# Altium project Project.PrjPcb
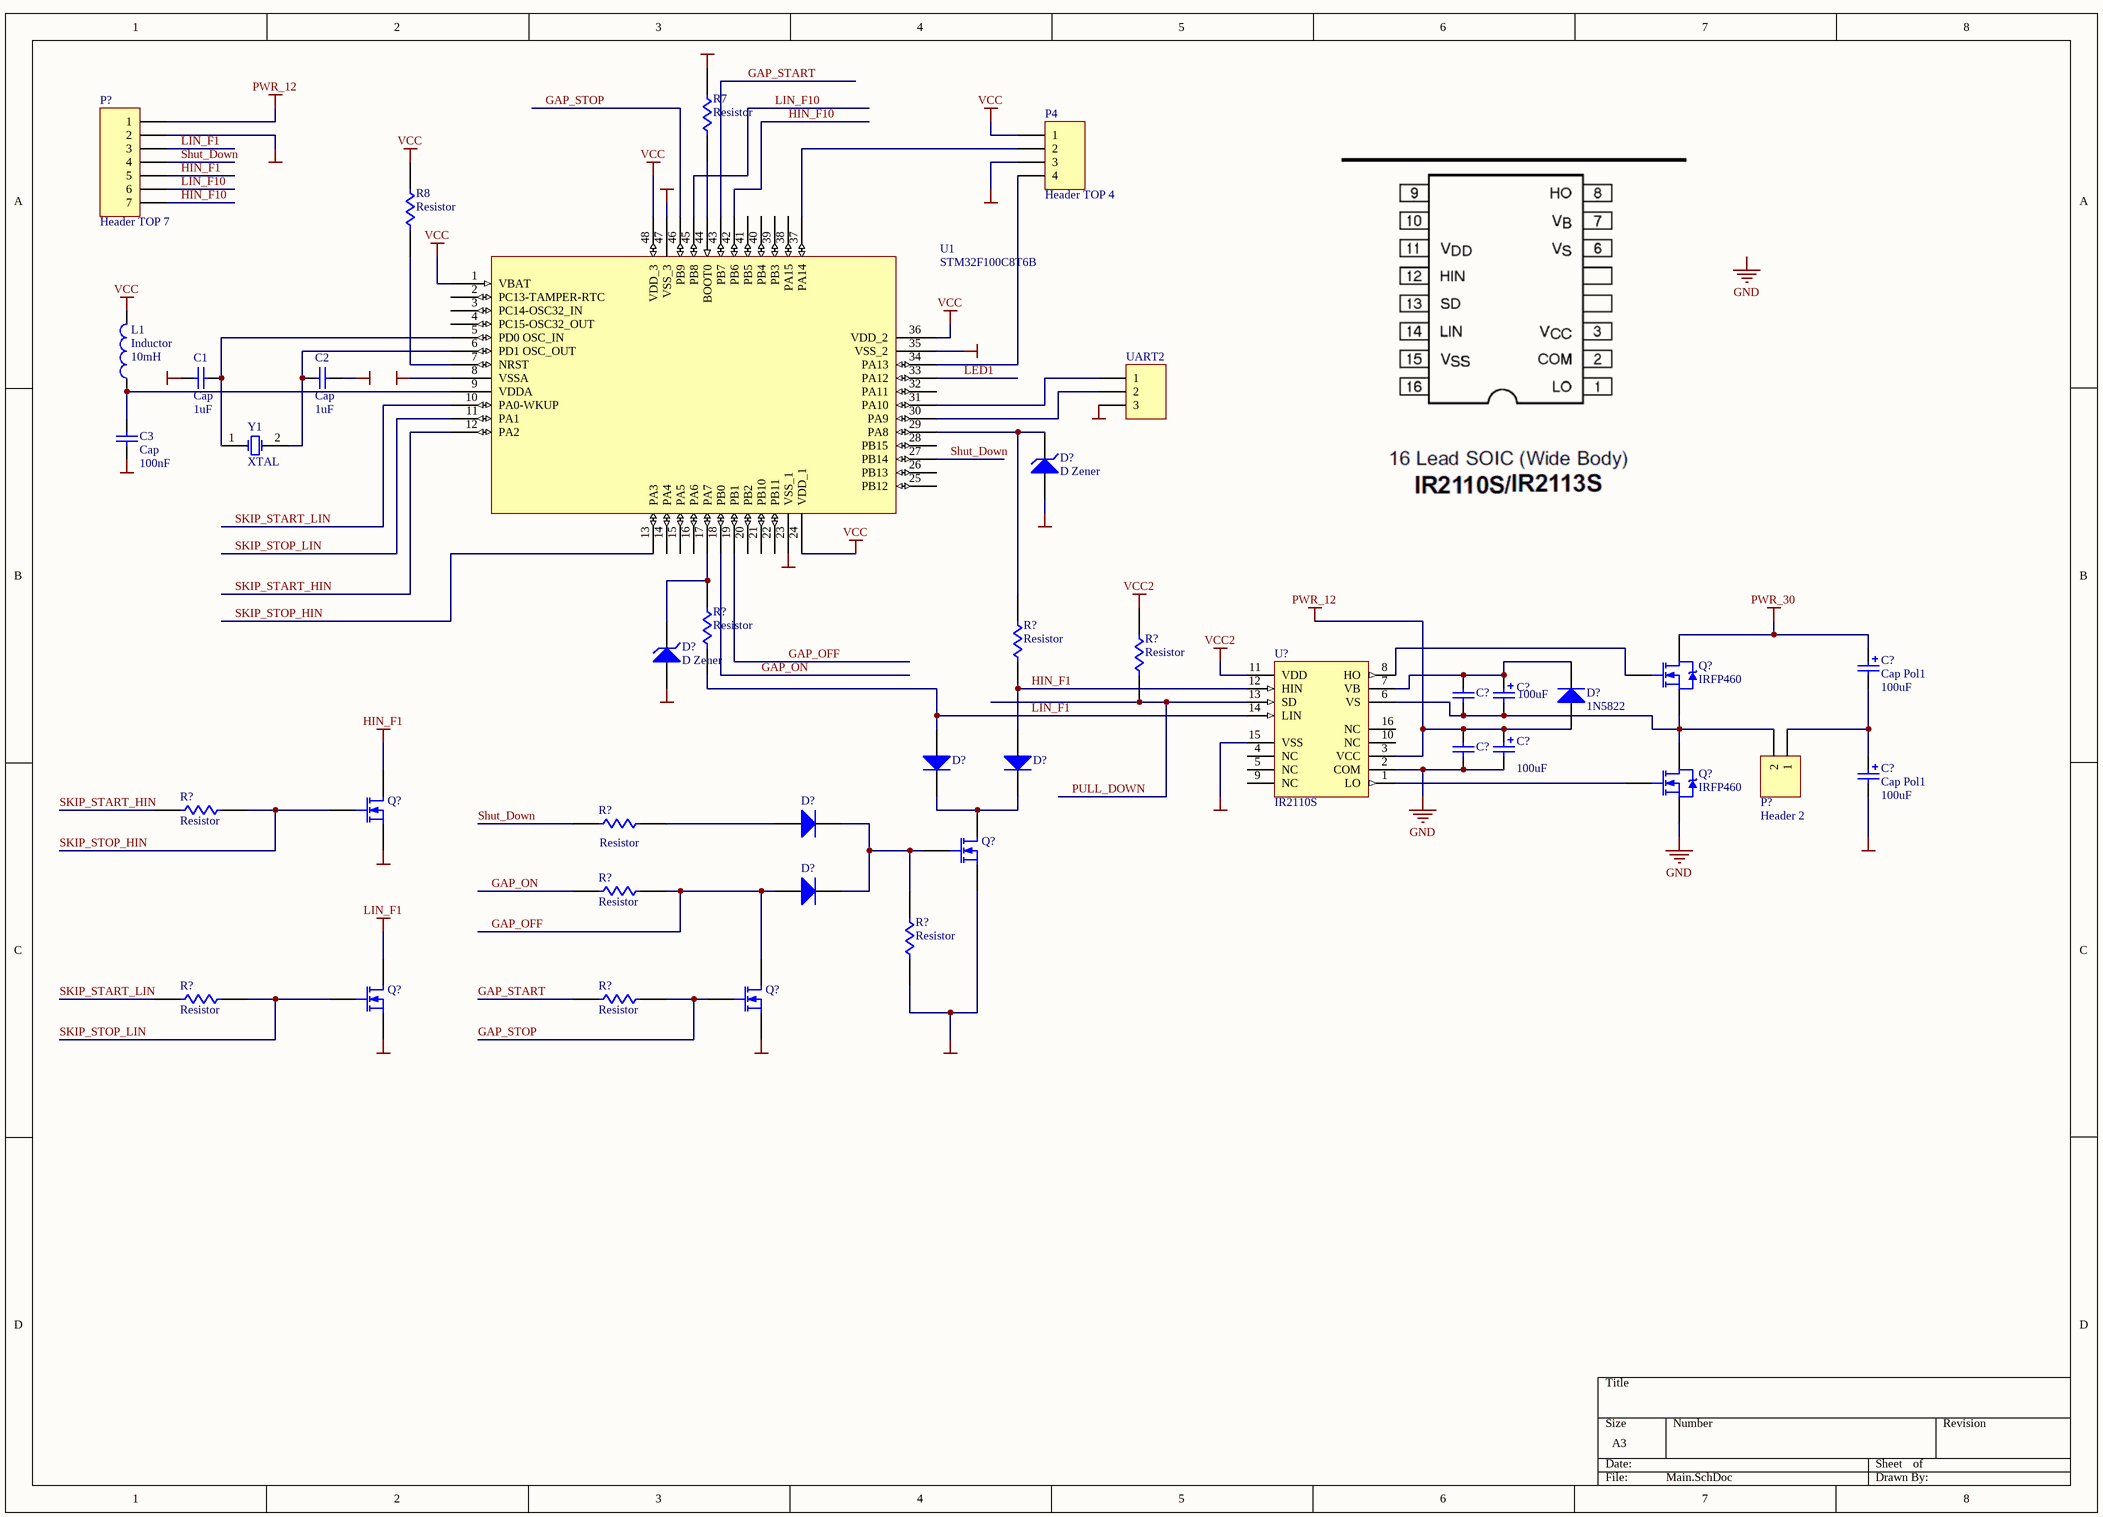
[diagram p0: Main.SchDoc]
2 sheets, 53 parts. Net scope: global (net labels, ports and power ports of the same name join across sheets).
Sheets:
  Main.SchDoc
  Uart.SchDoc

## Sheet Main.SchDoc
size A3; PageSetup: Record=PageOptions|CenterHorizontal=True|CenterVertical=True|PrintScale=1.47|XCorrection=1.00|YCorrection=1.00|PrintKind=1|BorderSize=5000000|LeftOffset=0|BottomOffset=0|Orientation=2|PaperLength=1000|PaperWidth=1000|Scale=100|PaperSource=7|PrintQuality=-4|MediaType=1|DitherType=10|PrintScaleMode=1|PaperKind=A2 420 x 594 мм

### Parts
(Parts that share a designator on the sheet are numbered #1, #2 ... from top to bottom, then left to right.)
C1  Cap  value 1uF  [6-0805_M]
C2  Cap  value 1uF  [6-0805_M]
C3  Cap  value 100nF  [6-0805_M]
C?#1  Cap Pol1  value 100uF  [RAD-0.3]
C?#2  value 100uF  [RAD-0.3]  (hidden comment: Cap Pol1)
C?#3  Cap  [RAD-0.3]  (value not drawn)
C?#4  value 100uF  [RAD-0.3]  (hidden comment: Cap Pol1)
C?#5  Cap  [RAD-0.3]  (value not drawn)
C?#6  Cap Pol1  value 100uF  [RAD-0.3]
D?#1  D Zener  [12Z-2010]
D?#2  D Zener  [12Z-2010]
D?#3  1N5822  [DO-41]
D?#4  Diode 1N4001  [DO-41]  (value not drawn)
D?#5  Diode 1N4001  [DO-41]  (value not drawn)
D?#6  Diode 1N4001  [DO-41]  (value not drawn)
D?#7  Diode 1N4001  [DO-41]  (value not drawn)
L1  Inductor  value 10mH  [INDC4532]
P4  Header TOP 4  [PIN_TOP_SMALL_4]
P?#1  Header TOP 7
P?#2  Header 2  [HDR1X2]
Q?#1  IRFP460  [TO-247AC]
Q?#2  IRFP460  [TO-247AC]
Q?#3  MOSFET-N  [E3]  (value not drawn)
Q?#4  MOSFET-N  [E3]  (value not drawn)
Q?#5  MOSFET-N  [E3]  (value not drawn)
Q?#6  MOSFET-N  [E3]  (value not drawn)
R7  Resistor  [6-0805_M]
R8  Resistor  [6-0805_M]
R?#1  Resistor  [6-0805_M]
R?#2  Resistor  [6-0805_M]
R?#3  Resistor  [6-0805_M]
R?#4  Resistor  [6-0805_M]
R?#5  Resistor  [6-0805_M]
R?#6  Resistor  [6-0805_M]
R?#7  Resistor  [6-0805_M]
R?#8  Resistor  [6-0805_M]
R?#9  Resistor  [6-0805_M]
U1  STM32F100C8T6B  [TQFP48_L]
U?#1  IR2110S  [SOIC16_M]
UART2  Header TOP 3  [PIN_TOP_SMALL_3]  (value not drawn)
Y1  XTAL  [RAD-0.3]

### Nets
GND: C1.2 C2.1 C3.1 C?#4.2 C?#5.1 C?#6.2 D?#1.2(A) D?#2.2(A) P4.3 P?#1.2 Q?#2.3(S) Q?#3.3(S) Q?#4.3(S) Q?#5.3(S) Q?#6.3(S) R7.1 R?#7.1 U1.8(VSSA) U1.23(VSS_1) U1.35(VSS_2) U1.47(VSS_3) U?#1.2(COM) U?#1.15(VSS) UART2.3
HIN_F1: D?#5.1(A) P?#1.5 Q?#3.1(D) R?#2.1 U?#1.12(HIN)
LIN_F1: D?#4.1(A) P?#1.3 Q?#5.1(D) R?#1.1 U?#1.14(LIN)
PWR_12: C?#4.1 C?#5.2 D?#3.1(A) P?#1.1 U?#1.3(VCC)
PWR_30: C?#1.1 Q?#1.2(D)
VCC: L1.2 P4.1 R8.1 U1.1(VBAT) U1.24(VDD_1) U1.36(VDD_2) U1.48(VDD_3)
VCC2: R?#3.1 U?#1.11(VDD)
GAP_OFF: D?#7.1(A) Q?#6.1(D) R?#6.1 U1.19(PB1)
GAP_ON: R?#6.2 U1.18(PB0)
GAP_START: R?#9.2 U1.43(PB7)
GAP_STOP: Q?#6.2(G) R?#9.1 U1.46(PB9)
HIN_F10: P?#1.7 U1.42(PB6)
LED1: U1.33(PA12)
LIN_F10: P?#1.6 U1.45(PB8)
PULL_DOWN: R?#3.2 U?#1.13(SD)
Shut_Down: P?#1.4 R?#5.1 U1.27(PB14)
SKIP_START_HIN: R?#4.2 U1.12(PA2)
SKIP_START_LIN: R?#8.2 U1.10(PA0-WKUP)
SKIP_STOP_HIN: Q?#3.2(G) R?#4.1 U1.13(PA3)
SKIP_STOP_LIN: Q?#5.2(G) R?#8.1 U1.11(PA1)
NetC1_1: C1.1 U1.5(PD0_OSC_IN) Y1.1(OSC1)
NetC2_2: C2.2 U1.6(PD1_OSC_OUT) Y1.2(OSC2)
NetC3_2: C3.2 L1.1 U1.9(VDDA)
NetC?#1_2: C?#1.2 C?#6.1 P?#2.1
NetC?#2_1: C?#2.1 C?#3.2 D?#3.2(K) U?#1.7(VB)
NetC?#2_2: C?#2.2 C?#3.1 P?#2.2 Q?#1.3(S) Q?#2.2(D) U?#1.6(VS)
NetD?#1_1: D?#1.1(K) R?#2.2 U1.29(PA8)
NetD?#2_1: D?#2.1(K) R?#1.2 U1.17(PA7)
NetD?#4_2: D?#4.2(K) D?#5.2(K) Q?#4.1(D)
NetD?#6_1: D?#6.1(A) R?#5.2
NetD?#6_2: D?#6.2(K) D?#7.2(K) Q?#4.2(G) R?#7.2
NetP4_2: P4.2 U1.37(PA14)
NetP4_4: P4.4 U1.34(PA13)
NetQ?#1_1: Q?#1.1(G) U?#1.8(HO)
NetQ?#2_1: Q?#2.1(G) U?#1.1(LO)
NetR7_2: R7.2 U1.44(BOOT0)
NetR8_2: R8.2 U1.7(NRST)
NetU1_30: U1.30(PA9) UART2.2
NetU1_31: U1.31(PA10) UART2.1

Not connected (* = marked no-connect by the designer): U1 2(PC13-TAMPER-RTC) 3(PC14-OSC32_IN) 4(PC15-OSC32_OUT) 14(PA4) 15(PA5) 16(PA6) 20(PB2) 21(PB10) 22(PB11) 25(PB12) 26(PB13) 28(PB15) 32(PA11) 38(PA15) 39(PB3) 40(PB4) 41(PB5); U?#1 4(NC) 5(NC) 9(NC) 10(NC) 16(NC)

### Notes on the sheet
- Labels drawn without touching a wire or pin: GND

### Library data of the parts
C1-C3 = Cap: Capacitor; Published: 8-Jun-2000; LatestRevisionDate: 17-Jul-2002; LatestRevisionNote: Re-released for DXP Platform.; PackageReference: RAD-0.3; Publisher: Altium Limited; PackageDescription: Radial Cap, Thru-Hole; 2 Leads; 0.3 in Pin Spacing
C?#1 C?#2 C?#4 C?#6 = Cap Pol1: Polarized Capacitor (Radial); Published: 8-Jun-2000; LatestRevisionDate: 17-Jul-2002; LatestRevisionNote: Re-released for DXP Platform.; PackageReference: RB7.6-15; Publisher: Altium Limited; PackageDescription: Polarized Capacitor (Radial); 2 Leads
C?#3 C?#5 = Cap: Capacitor; Value: 100pF; Published: 8-Jun-2000; LatestRevisionDate: 17-Jul-2002; LatestRevisionNote: Re-released for DXP Platform.; PackageReference: RAD-0.3; Publisher: Altium Limited; PackageDescription: Radial Cap, Thru-Hole; 2 Leads; 0.3 in Pin Spacing
D?#1 D?#2 = D Zener: Zener Diode; Published: 8-Jun-2000; LatestRevisionDate: 17-Jul-2002; LatestRevisionNote: Re-released for DXP Platform.; PackageReference: DIODE-0.7; Publisher: Altium Limited; PackageDescription: Diode, Thru-Hole; 2 Leads; 0.7 in Pin Spacing
D?#3-D?#7 = Diode 1N4001: 1 Amp General Purpose Rectifier; Published: 8-Jun-2000; LatestRevisionDate: 17-Jul-2002; LatestRevisionNote: Re-released for DXP Platform.; DatasheetVersion: 1998; PackageVersion: Aug-1999; PackageReference: DO-41; Publisher: Altium Limited; PackageDescription: Diode, Axial; Body 5.2 x 2.7 mm (LxDia. max), Lead Dia. 0.86 mm (max); Code_JEDEC: DO-204-AL; ComponentLink1Description: Manufacturer Link; ComponentLink1URL: http://www.fairchildsemi.com/; ComponentLink2Description: Datasheet; ComponentLink2URL: http://www.fairchildsemi.com/ds/1N%2F1N4001.pdf
L1 = Inductor: Code_IEC: 1005; Published: 8-Jun-2000; LatestRevisionDate: 29-May-2009; LatestRevisionNote: IPC-7351 Footprint Added.; PackageReference: 0402-A; Publisher: Altium Limited; PackageDescription: Chip Inductor; Code_JEITA: 0402
P4 = Header TOP 4: Header, 1Pin; LatestRevisionDate: 17-Jul-2002; LatestRevisionNote: Re-released for DXP Platform.; Publisher: Altium Limited
P?#1 = Header TOP 7: Header, 1Pin; LatestRevisionDate: 17-Jul-2002; LatestRevisionNote: Re-released for DXP Platform.; Publisher: Altium Limited
P?#2 = Header 2: Header, 2-Pin; LatestRevisionDate: 17-Jul-2002; LatestRevisionNote: Re-released for DXP Platform.; Publisher: Altium Limited
Q?#1 Q?#2 = IRFP460: HEXFET Power MOSFET; Note: Pin 2 is electrically connected to the Heatsink (4).; Published: 8-Jun-2000; LatestRevisionDate: 17-Jul-2002; LatestRevisionNote: Re-released for DXP Platform.; DatasheetVersion: PD-9.512B; PackageVersion: Aug-1997; PackageReference: TO-247AC; Publisher: Altium Limited; PackageDescription: SIP with Mounting Hole; 3 Leads; Body 20 x 15.6 x 5 mm (typ); Pitch 5.45 mm; Code_JEDEC: TO-247-AC; ComponentLink1Description: Manufacturer Link; ComponentLink1URL: http://www.irf.com/; ComponentLink2Description: Datasheet; ComponentLink2URL: http://www.irf.com/product-info/datasheets/data/irfp460.pdf
Q?#3-Q?#6 = MOSFET-N: N-Channel MOSFET; Published: 8-Jun-2000; LatestRevisionDate: 17-Jul-2002; LatestRevisionNote: Re-released for DXP Platform.; PackageVersion: 1995/1996; PackageReference: E3; Publisher: Altium Limited; PackageDescription: TO, Flat Index; 3 In-Line, Axial Leads; Body Dia. 4.6mm; Lead Dia. 0.5 mm (max)
U1 = STM32F100C8T6B: STM32 ARM-based 32-bit MCU with 32 Kbytes Flash, 48-pin LQFP, Industrial Temperature; Published: 30-May-2008; DatasheetVersion: rev6, Mar-2008; PackageVersion: Mar-2008; PackageReference: LQFP48; Publisher: Altium Limited; PackageDescription: 48-Pin Low-Profile Quad Flat Pack, 7 x 7 mm Body, 0.5 mm Pitch (LQFP48); ComponentLink1Description: Manufacturer Link; ComponentLink1URL: www.st.com/stm32; ComponentLink2Description: Datasheet; ComponentLink2URL: http://www.st.com/stonline/products/literature/ds/13586.pdf
U?#1 = IR2110S: High and Low Side Driver; Note: Pins 4, 5, 9, 10 and 16 are not connected; Published: 8-Jun-2000; LatestRevisionDate: 13-Apr-2006; LatestRevisionNote: IPC-7351 Footprint Added.; DatasheetVersion: PD60147J; PackageReference: SOIC16; Publisher: Altium Limited; PackageDescription: 16-Pin Small Outline Integrated Circuit 1.27 mm Pitch; Code_JEDEC: MS-013-AA; Code_IPC: SOIC127P1030-16; ComponentLink1Description: Manufacturer Link; ComponentLink1URL: http://www.irf.com/; ComponentLink2Description: Datasheet; ComponentLink2URL: http://www.irf.com/product-info/datasheets/data/ir2110.pdf
UART2 = Header TOP 3: Header, 1Pin; LatestRevisionDate: 17-Jul-2002; LatestRevisionNote: Re-released for DXP Platform.; Publisher: Altium Limited
Y1 = XTAL: Crystal Oscillator; Published: 8-Jun-2000; LatestRevisionDate: 17-Jul-2002; LatestRevisionNote: Re-released for DXP Platform.; PackageReference: R38; Publisher: Altium Limited; PackageDescription: Crystal, Thru-Hole; 2 Leads; Body 3.1 x 8.2 mm (Dia.xH)
R7 R8 R?#1-R?#9 = Resistor: Published: 24-Mar-1999; LatestRevisionDate: 29-May-2009; LatestRevisionNote: IPC-7351 Footprint Added.; PackageVersion: Mar-2003; PackageReference: 6-0805; Publisher: Altium Limited; PackageDescription: Chip Resistor 0805 Case Size; Code_IPC: RESC2012

## Sheet Uart.SchDoc
size A4
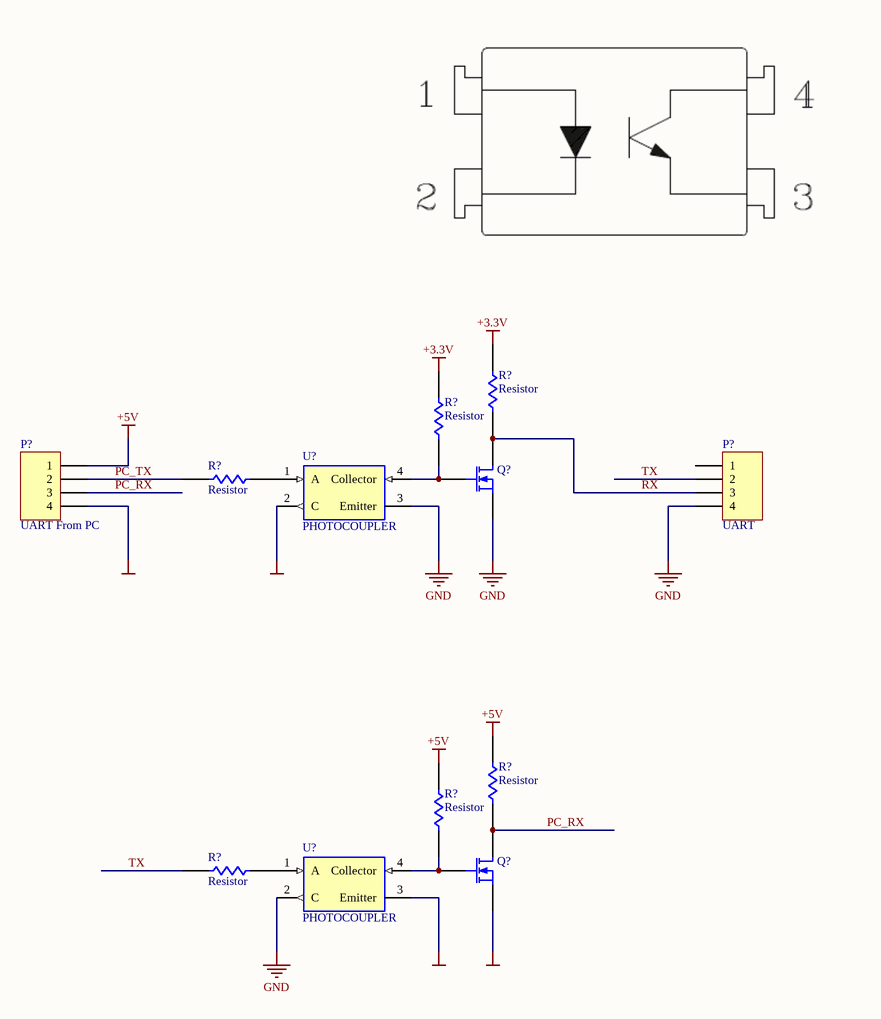
[diagram p1: Uart.SchDoc]

### Parts
(Parts that share a designator on the sheet are numbered #1, #2 ... from top to bottom, then left to right.)
P?#3  UART From PC  [PIN_TOP_SMALL_4]
P?#4  UART  [PIN_TOP_SMALL_4]
Q?#7  MOSFET-N  [E3]  (value not drawn)
Q?#8  MOSFET-N  [E3]  (value not drawn)
R?#10  Resistor  [6-0805_M]
R?#11  Resistor  [6-0805_M]
R?#12  Resistor  [6-0805_M]
R?#13  Resistor  [6-0805_M]
R?#14  Resistor  [6-0805_M]
R?#15  Resistor  [6-0805_M]
U?#2  PHOTOCOUPLER  [SOT23-5_M]
U?#3  PHOTOCOUPLER  [SOT23-5_M]

### Nets
+3.3V: R?#10.1 R?#11.1
+5V: P?#3.1 R?#13.1 R?#14.1
GND: P?#3.4 P?#4.4 Q?#7.3(S) Q?#8.3(S) U?#2.2(C) U?#2.3(Emitter) U?#3.2(C) U?#3.3(Emitter)
PC_RX: P?#3.3 Q?#8.1(D) R?#13.2
PC_TX: P?#3.2 R?#12.2
RX: P?#4.3 Q?#7.1(D) R?#10.2
TX: P?#4.2 R?#15.2
NetQ?#7_2: Q?#7.2(G) R?#11.2 U?#2.4(Collector)
NetQ?#8_2: Q?#8.2(G) R?#14.2 U?#3.4(Collector)
NetR?#12_1: R?#12.1 U?#2.1(A)
NetR?#15_1: R?#15.1 U?#3.1(A)

Not connected (* = marked no-connect by the designer): P?#4 1

### Library data of the parts
P?#3 P?#4 = Header TOP 4: Header, 1Pin; LatestRevisionDate: 17-Jul-2002; LatestRevisionNote: Re-released for DXP Platform.; Publisher: Altium Limited
Q?#7 Q?#8 = MOSFET-N: N-Channel MOSFET; Published: 8-Jun-2000; LatestRevisionDate: 17-Jul-2002; LatestRevisionNote: Re-released for DXP Platform.; PackageVersion: 1995/1996; PackageReference: E3; Publisher: Altium Limited; PackageDescription: TO, Flat Index; 3 In-Line, Axial Leads; Body Dia. 4.6mm; Lead Dia. 0.5 mm (max)
U?#2 U?#3 = K1010: Published: 24-Mar-1999; LatestRevisionDate: 17-Jul-2002; LatestRevisionNote: Re-released for DXP Platform.; PackageReference: DIP-6; Publisher: Altium Limited; Code_JEDEC: MO-001-AM
R?#10-R?#15 = Resistor: Published: 24-Mar-1999; LatestRevisionDate: 29-May-2009; LatestRevisionNote: IPC-7351 Footprint Added.; PackageVersion: Mar-2003; PackageReference: 6-0805; Publisher: Altium Limited; PackageDescription: Chip Resistor 0805 Case Size; Code_IPC: RESC2012

## Nets that join several sheets
GND: Main (24 pins), Uart (8 pins)